# Altium schematic sheet Fiber_interlock.SchDoc
size 420 x 297 mm; Address1: Address1; Address2: Address2; Address3: Address3; Address4: Address4; DocumentNumber: *Э3; SheetNumber: 8; SheetTotal: 12; DocumentType: Схема электрическая *
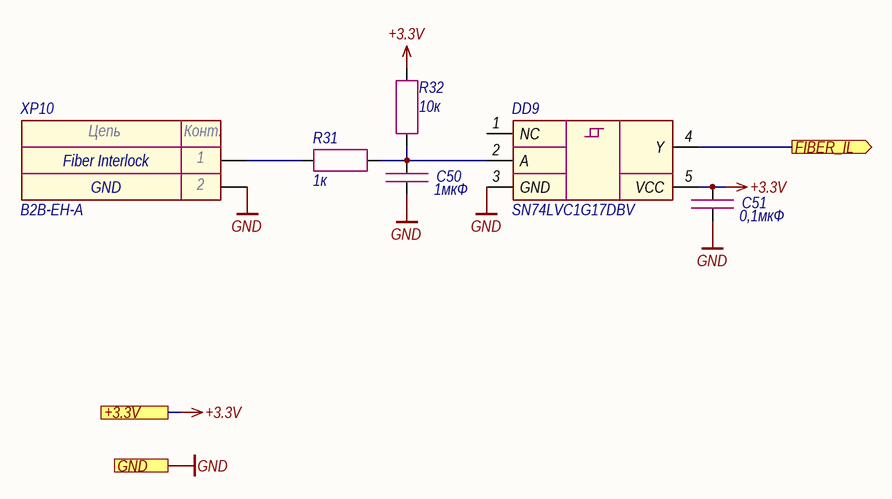
[diagram p0: Fiber_interlock.SchDoc]

## Parts
C50  1мкФ  [CAP_0603]
C51  0,1мкФ  [CAP_0603]
DD9  SN74LVC1G17DBV  [SOT-23-5]
R31  1к  [RES_0603]
R32  10к  [RES_0603]
XP10  B2B-EH-A  [B2B-EH-A]

## Ports
+3.3V (see Main[2A], Bus[1D], Button[1D], Ethernet[3D], Flow_sensor[2C], Hardwiring[3D]), FIBER_IL (out, see Main[3A]), GND (see Main[2A], Bus[1D], Button[1D], Column[1C], Ethernet[3D], Flow_sensor[2C], Guide_laser[1C], Hardwiring[3D], Indication[1C])

## Nets
+3.3V: C51.1 DD9.5(VCC) R32.2 ; port +3.3V
GND: C50.2 C51.2 DD9.3(GND) XP10.2 ; port GND
FIBER_IL: DD9.4(Y) ; port FIBER_IL
NetC50_1: C50.1 DD9.2(A) R31.2 R32.1
NetR31_1: R31.1 XP10.1

Not connected (* = marked no-connect by the designer): DD9 1(NC)

## Notes on the sheet
- (near XP10) Fiber Interlock
- GND
- Подп. и дата
- Инв. № дубл.
- Взам. инв. №
- Инв. № подл.
- Изм.
- Лист
- № докум.
- Подп.
- Дата
- Копировал
- Формат А3
- (in symbol Connector-2) Цепь; Конт.

## Library data of the parts
C50 = Capacitor: Manufacturer: Murata; Model: GRM188R61H105KAALD; Value: 1мкФ; Document: *
C51 = Capacitor: Manufacturer: Murata; Model: GRM188R71H104KA93D; Value: 0,1мкФ; Document: *
DD9 = SN74LVC1G17: Manufacturer: Texas Instruments; Model: SN74LVC1G17DBV; Document: *
R31 = Resistor: Manufacturer: Yageo; Model: RC0603FR-071KL; Value: 1к; Document: *
R32 = Resistor: Manufacturer: Yageo; Model: RC0603FR-0710KL; Value: 10к; Document: *
XP10 = Connector-2: Manufacturer: JST; Model: B2B-EH-A; Document: *